# Altium schematic sheet Arriquitaun2.SchDoc
size A3
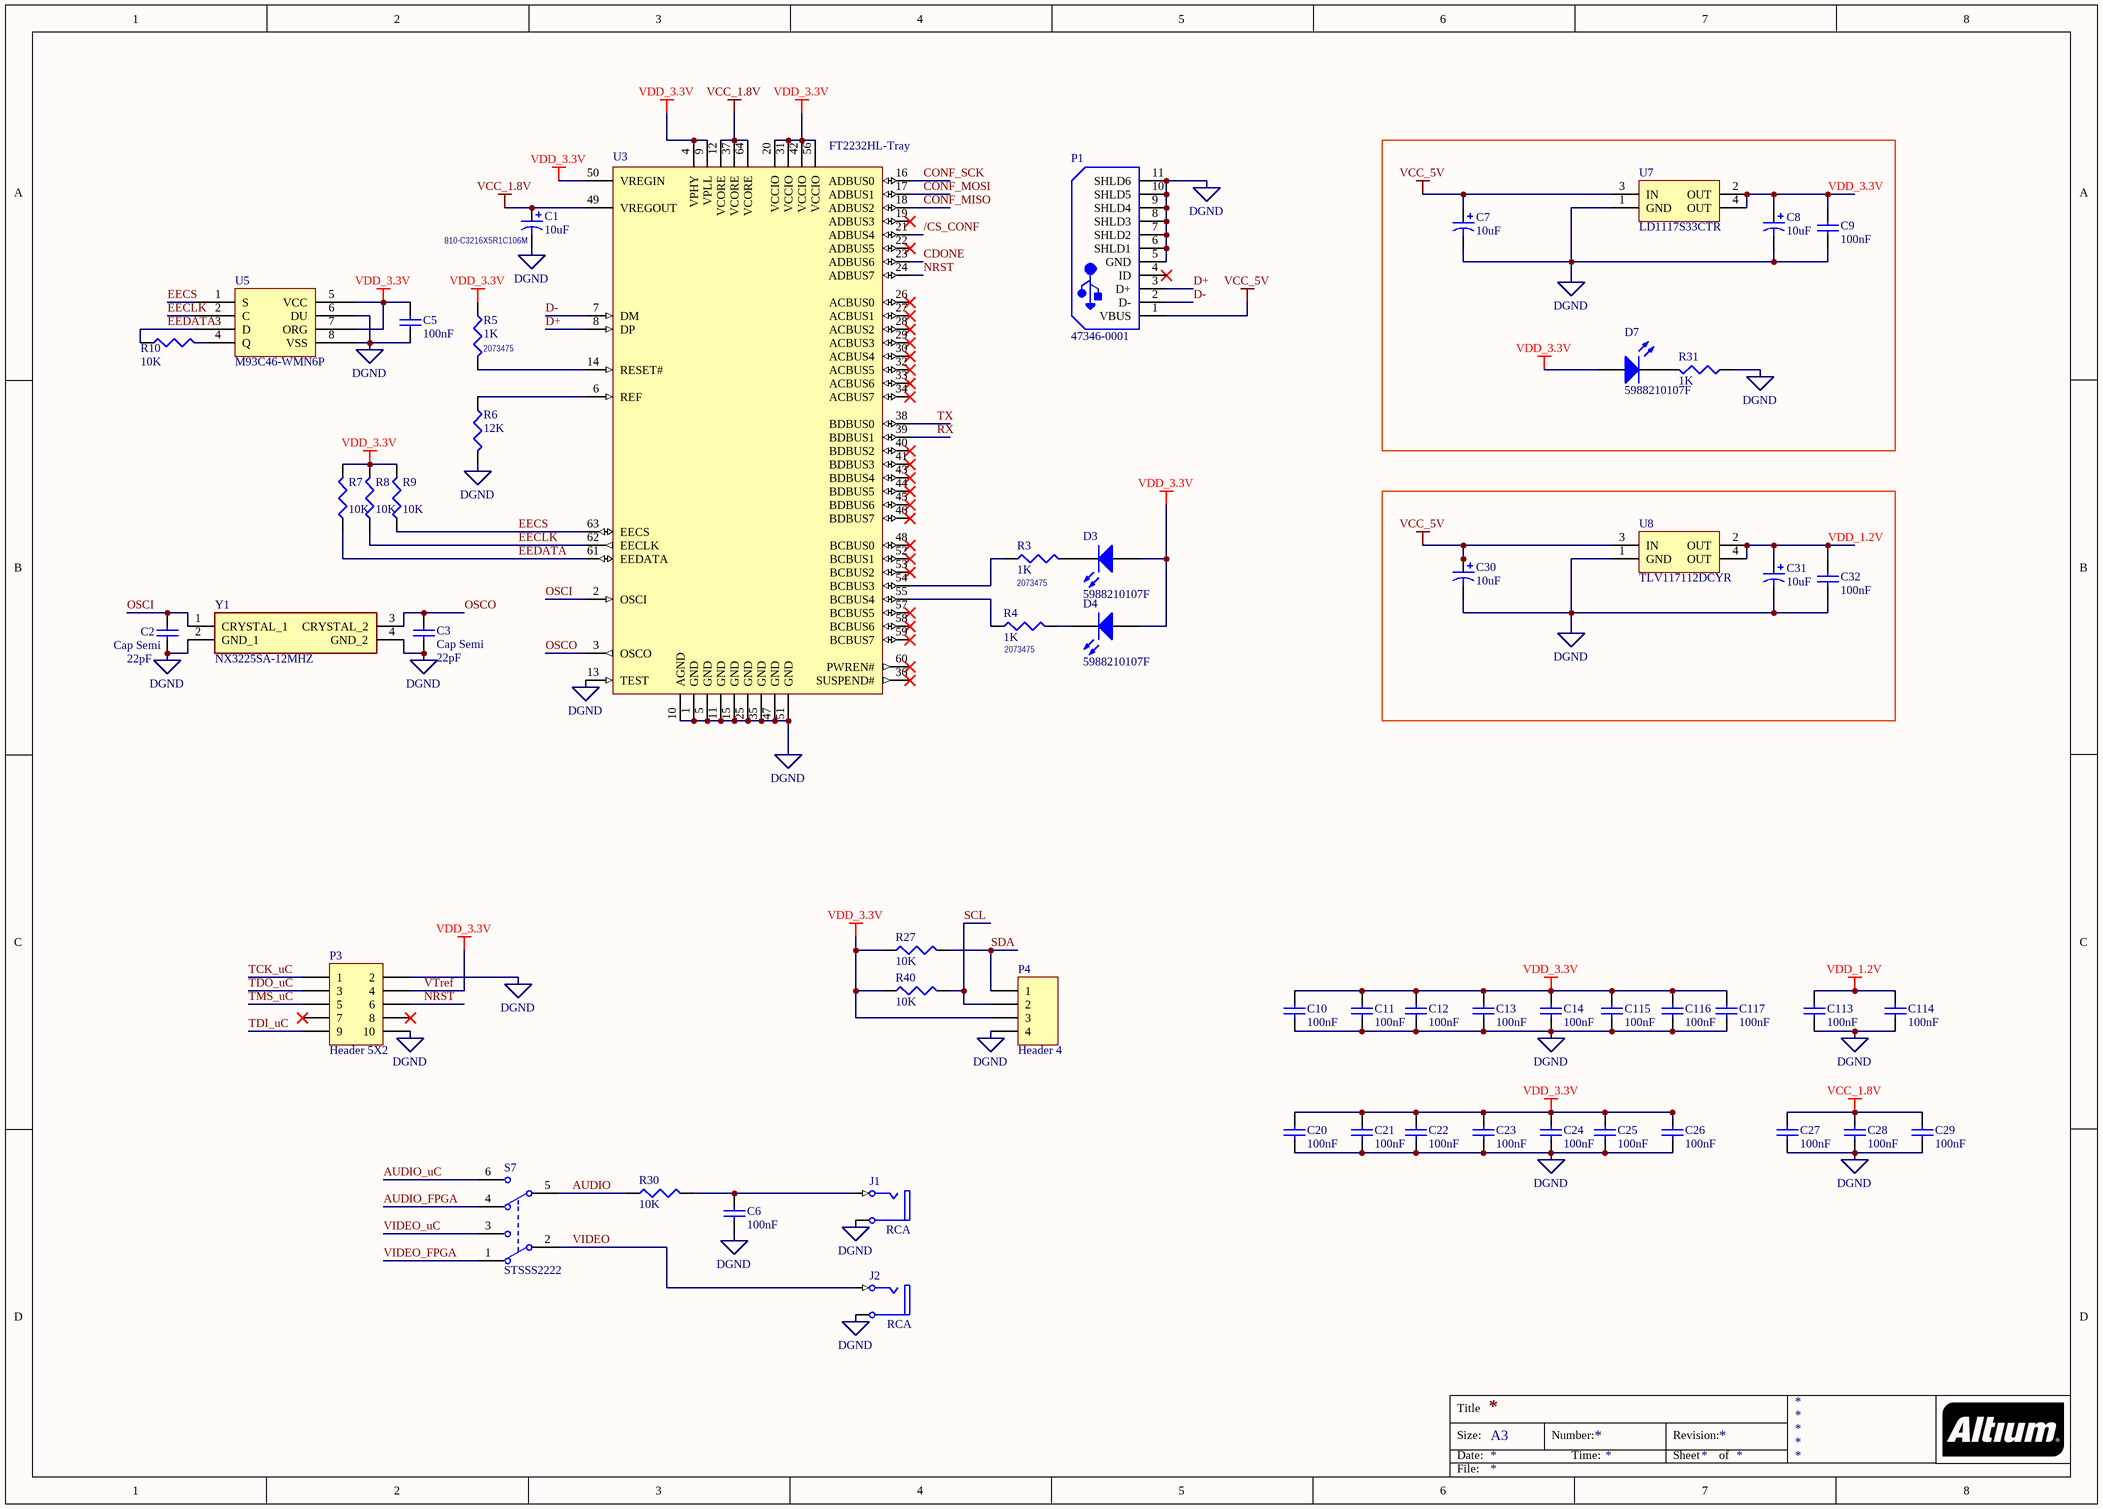
[diagram p0: Arriquitaun2.SchDoc]

## Parts
C1  value 10uF  Supplier part number 1: 810-C3216X5R1C106M  [C1206]  (hidden comment: Cap Pol1)
C2  Cap Semi  value 22pF  [C1206]
C3  Cap Semi  value 22pF  [C1206]
C5  value 100nF  [C1206]  (hidden comment: Cap Semi)
C6  value 100nF  [C1206]  (hidden comment: Cap Semi)
C7  value 10uF  [C1206]  (hidden comment: Cap Pol1)
C8  value 10uF  [C1206]  (hidden comment: Cap Pol1)
C9  value 100nF  [C1206]  (hidden comment: Cap Semi)
C10  value 100nF  [C1206]  (hidden comment: Cap Semi)
C11  value 100nF  [C1206]  (hidden comment: Cap Semi)
C12  value 100nF  [C1206]  (hidden comment: Cap Semi)
C13  value 100nF  [C1206]  (hidden comment: Cap Semi)
C14  value 100nF  [C1206]  (hidden comment: Cap Semi)
C20  value 100nF  [C1206]  (hidden comment: Cap Semi)
C21  value 100nF  [C1206]  (hidden comment: Cap Semi)
C22  value 100nF  [C1206]  (hidden comment: Cap Semi)
C23  value 100nF  [C1206]  (hidden comment: Cap Semi)
C24  value 100nF  [C1206]  (hidden comment: Cap Semi)
C25  value 100nF  [C1206]  (hidden comment: Cap Semi)
C26  value 100nF  [C1206]  (hidden comment: Cap Semi)
C27  value 100nF  [C1206]  (hidden comment: Cap Semi)
C28  value 100nF  [C1206]  (hidden comment: Cap Semi)
C29  value 100nF  [C1206]  (hidden comment: Cap Semi)
C30  value 10uF  [C1206]  (hidden comment: Cap Pol1)
C31  value 10uF  [C1206]  (hidden comment: Cap Pol1)
C32  value 100nF  [C1206]  (hidden comment: Cap Semi)
C113  value 100nF  [C1206]  (hidden comment: Cap Semi)
C114  value 100nF  [C1206]  (hidden comment: Cap Semi)
C115  value 100nF  [C1206]  (hidden comment: Cap Semi)
C116  value 100nF  [C1206]  (hidden comment: Cap Semi)
C117  value 100nF  [C1206]  (hidden comment: Cap Semi)
D3  5988210107F  [1206 - LED]
D4  5988210107F  [1206 - LED]
D7  5988210107F  [1206 - LED]
J1  RCA  [161]
J2  RCA  [161]
P1  47346-0001  [USB-MICRO-B_V]
P3  Header 5X2  [HDR2X5]
P4  Header 4  [HDR1X4]
R3  value 1K  Supplier Part Number 1: 2073475  [c1206]  (hidden comment: Res3)
R4  value 1K  Supplier Part Number 1: 2073475  [c1206]  (hidden comment: Res3)
R5  value 1K  Supplier Part Number 1: 2073475  [c1206]  (hidden comment: Res3)
R6  value 12K  [c1206]  (hidden comment: Res3)
R7  value 10K  [c1206]  (hidden comment: Res3)
R8  value 10K  [c1206]  (hidden comment: Res3)
R9  value 10K  [c1206]  (hidden comment: Res3)
R10  value 10K  [c1206]  (hidden comment: Res3)
R27  value 10K  [c1206]  (hidden comment: Res3)
R30  value 10K  [c1206]  (hidden comment: Res3)
R31  value 1K  [c1206]  (hidden comment: Res3)
R40  value 10K  [c1206]  (hidden comment: Res3)
S7  STSSS2222  [SWITCH]
U3  FT2232HL-Tray  [LQFP-64_N]
U5  M93C46-WMN6P  [SOP8_N]
U7  LD1117S33CTR  [ZZ311]
U8  TLV117112DCYR  [ZZ311]
Y1  NX3225SA-12MHZ  [NX3225SA12000MHZSTDCSR1]

## Nets
DGND: C1.2 C2.2 C3.1 C5.1 C6.1 C7.2 C8.2 C9.1 C10.1 C11.1 C12.1 C13.1 C14.1 C20.1 C21.1 C22.1 C23.1 C24.1 C25.1 C26.1 C27.1 C28.1 C29.1 C30.2 C31.2 C32.1 C113.1 C114.1 C115.1 C116.1 C117.1 J1.1A(Ground) J2.1A(Ground) P1.5(GND) P1.6(SHLD1) P1.7(SHLD2) P1.8(SHLD3) P1.9(SHLD4) P1.10(SHLD5) P1.11(SHLD6) P3.2 P3.10 P4.4 R6.2 R31.1 U3.1(GND) U3.5(GND) U3.10(AGND) U3.11(GND) U3.13(TEST) U3.15(GND) U3.25(GND) U3.35(GND) U3.47(GND) U3.51(GND) U5.6(DU) U5.8(VSS) U7.1(GND) U8.1(GND) Y1.2(GND_1) Y1.4(GND_2)
VCC_1.8V: C1.1 C27.2 C28.2 C29.2 U3.12(VCORE) U3.37(VCORE) U3.49(VREGOUT) U3.64(VCORE)
VCC_5V: C7.1 C30.1 P1.1(VBUS) U7.3(IN) U8.3(IN)
VDD_1.2V: C31.1 C32.2 C113.2 C114.2 U8.2(OUT) U8.4(OUT)
VDD_3.3V: C5.2 C8.1 C9.2 C10.2 C11.2 C12.2 C13.2 C14.2 C20.2 C21.2 C22.2 C23.2 C24.2 C25.2 C26.2 C115.2 C116.2 C117.2 D3.1(A) D4.1(A) D7.1(A) P3.4 P4.3 R5.1 R7.2 R8.2 R9.2 R27.1 R40.1 U3.4(VPHY) U3.9(VPLL) U3.20(VCCIO) U3.31(VCCIO) U3.42(VCCIO) U3.50(VREGIN) U3.56(VCCIO) U5.5(VCC) U5.7(ORG) U7.2(OUT) U7.4(OUT)  [also labelled VTref]
/CS_CONF: U3.21(ADBUS4)
AUDIO: R30.1 S7.5(COMMON2)
AUDIO_FPGA: S7.4(NC2)
AUDIO_uC: S7.6(NO2)
CDONE: U3.23(ADBUS6)
CONF_MISO: U3.18(ADBUS2)
CONF_MOSI: U3.17(ADBUS1)
CONF_SCK: U3.16(ADBUS0)
D+: P1.3(D+) U3.8(DP)
D-: P1.2(D-) U3.7(DM)
EECLK: R8.1 U3.62(EECLK) U5.2(C)
EECS: R9.1 U3.63(EECS) U5.1(S)
EEDATA: R7.1 R10.1 U3.61(EEDATA) U5.3(D)
NRST: P3.6 U3.24(ADBUS7)
OSCI: C2.1 U3.2(OSCI) Y1.1(CRYSTAL_1)
OSCO: C3.2 U3.3(OSCO) Y1.3(CRYSTAL_2)
RX: U3.39(BDBUS1)
SCL: P4.2 R40.2
SDA: P4.1 R27.2
TCK_uC: P3.1
TDI_uC: P3.9
TDO_uC: P3.3
TMS_uC: P3.5
TX: U3.38(BDBUS0)
VIDEO: J2.2B(Signal) S7.2(COMMON1)
VIDEO_FPGA: S7.1(NC1)
VIDEO_uC: S7.3(NO1)
NetC6_2: C6.2 J1.2B(Signal) R30.2
NetD3_2: D3.2(K) R3.2
NetD4_2: D4.2(K) R4.2
NetD7_2: D7.2(K) R31.2
NetR3_1: R3.1 U3.54(BCBUS3)
NetR4_1: R4.1 U3.55(BCBUS4)
NetR5_2: R5.2 U3.14(RESET#)
NetR6_1: R6.1 U3.6(REF)
NetR10_2: R10.2 U5.4(Q)

Not connected (* = marked no-connect by the designer): P1 4(ID)*; P3 7* 8*; U3 19(ADBUS3)* 22(ADBUS5)* 26(ACBUS0)* 27(ACBUS1)* 28(ACBUS2)* 29(ACBUS3)* 30(ACBUS4)* 32(ACBUS5)* 33(ACBUS6)* 34(ACBUS7)* 36(SUSPEND#)* 40(BDBUS2)* 41(BDBUS3)* 43(BDBUS4)* 44(BDBUS5)* 45(BDBUS6)* 46(BDBUS7)* 48(BCBUS0)* 52(BCBUS1)* 53(BCBUS2)* 57(BCBUS5)* 58(BCBUS6)* 59(BCBUS7)* 60(PWREN#)*

## Notes on the sheet
- Title
- Size:
- Date:
- A3
- Number:
- Time:
- Revision:
- Sheet
- of
- File:

## Library data of the parts
C1 C7 C8 C30 C31 = Cap Pol1: Polarized Capacitor (Radial); Published: 8-Jun-2000; LatestRevisionDate: 17-Jul-2002; LatestRevisionNote: Re-released for DXP Platform.; PackageReference: RB7.6-15; Publisher: Altium Limited; PackageDescription: Polarized Capacitor (Radial); 2 Leads; Supplier 1: Mouser
  C7 C8 C30 C31: Supplier part number 1: 810-C3216X5R1C106M
C2 C3 C5 C6 C9-C14 C20-C29 C32 C113-C117 = Cap Semi: Capacitor (Semiconductor SIM Model); Published: 8-Jun-2000; LatestRevisionDate: 29-May-2009; LatestRevisionNote: IPC-7351 Footprint Added.; PackageReference: C1206; Publisher: Altium Limited; PackageDescription: Chip Capacitor
  C5: Supplier 1: Mouser
  C6 C9 C32: Supplier 1: Farnell; Supplier part number 1: 1759123
  C10-C14 C20-C29 C113-C117: Supplier 1: Mouser; Supplier Part Number 1: 81-GRM31CR72D104KW3L
D3 D4 D7 = 5988210107F: LED, Rojo, Montaje Superficial, 1206 (Métrico 3216), 20 mA, 2 V, 640 nm; Published: 8-Jun-2000; LatestRevisionDate: 17-Jul-2002; LatestRevisionNote: Re-released for DXP Platform.; PackageVersion: Feb-2002; PackageReference: 3.2X1.6X1.1; Publisher: Altium Limited; PackageDescription: SM LED; 2 Flat Leads; Supplier 1: Farnell; Supplier Part Number 1: 1465997; ComponentLink1Description: Mouser; ComponentLink1URL: https://eu.mouser.com/ProductDetail/Dialight/598-8210-107F?qs=sGAEpiMZZMseGfSY3csMkcUUSK%2FIVnSgwPTZO%252Bt9HCE%3D; Supplier 2: Mouser; Supplier Part Number 2: 645-598-8210-107F
J1 J2 = RCA: RCA Phono Jack, Right Angle, Thru-Hole, Snap-In; PCB_Layout: Complies with manufacturer's recommendation.; DrillAndSlotSize: Corresponds to nominal value.; Published: 15-Jul-2004; LatestRevisionDate: 15-Jul-2004; LatestRevisionNote: Component Replaced.; DatasheetDocument: 7-Jul-2000; PackageDocument: 7-Jul-2000; PackageReference: 161; Publisher: Altium Limited; ComponentLink1Description: Manufacturer Link; ComponentLink1URL: http://www.mouser.com/kobiconn/
P1 = 47346-0001: Conectores USB MICRO USB B RECPT BTTM MOUNT ASSY; Supplier 1: Mouser; ComponentLink1Description: Mouser; ComponentLink1URL: https://eu.mouser.com/ProductDetail/Molex/47346-0001?qs=%2Fha2pyFadugJe2m2PwsxZF%2FSs5SLGnHK0WVEsekv2hnqwx5TiE8qVw%3D%3D&utm_source=octopart&utm_medium=aggregator&utm_campaign=538-47346-0001&utm_content=Molex; Supplier Part Number 1: 538-47346-0001; Supplier 2: Farnell; Supplier Part Number 2: 2119232
P3 = Header 5X2: Header, 5-Pin, Dual row; LatestRevisionDate: 17-Jul-2002; LatestRevisionNote: Re-released for DXP Platform.; Publisher: Altium Limited; Supplier 1: Farnell; Supplier Part Number 1: 1593415
P4 = Header 4: Header, 4-Pin; LatestRevisionDate: 17-Jul-2002; LatestRevisionNote: Re-released for DXP Platform.; Publisher: Altium Limited
R3-R10 R27 R30 R31 R40 = Res3: Resistor; Published: 8-Jun-2000; LatestRevisionDate: 29-May-2009; LatestRevisionNote: IPC-7351 Footprint Added.; PackageReference: J1-0603; Publisher: Altium Limited; PackageDescription: Chip Resistor
  R3-R6: Supplier 1: Farnell
  R27 R30 R40: Supplier 1: Farnell; Supplier Part Number 1: 2073356
  R31: Supplier 1: Farnell; Supplier Part Number 1: 2073475
S7 = STSSS2222: Interruptor Deslizante, DPDT, Taladro Pasante, Serie STSS2, 300 mA; Supplier 1: Farnell; Supplier Part Number 1: 1123873; Supplier 2: Newark; Supplier Part Number 2: 34M8660
U3 = FT2232HL-Tray: Dual High Speed USB To Multipurpose UART/FIFO IC, 64-pin LQFP, Tray; Manufacturer: FTDI; DatasheetVersion: ver 2.21, Jun-2012; PackageVersion: Jun-12; PackageReference: LQFP-64; PackageDescription: 64-Pin Thin Quad Flat Pack, 10 x 10 x 1.4 mm Body, 0.5 mm Pitch; PartNumber: FT2232HL-Tray; ComponentLink1Description: Manufacturer URL; ComponentLink1URL: http://www.ftdichip.com/; ComponentLink2Description: Datasheet; ComponentLink2URL: http://www.ftdichip.com/Support/Documents/DataSheets/ICs/DS_FT2232H.pdf; Supplier 1: Mouser; Supplier Part Number 1: 895-FT2232HL; Supplier 2: Digi-Key; Supplier Part Number 2: 768-1347-ND
U5 = M93C46-WMN6P: EEPROM 1 Kbit (128 x 8) 2.5V to 5.5V EEProm; Supplier 1: Mouser; Supplier Part Number 1: 511-M93C46-WMN6P; Supplier 2: Farnell; Supplier Part Number 2: 1224432; Supplier 3: Digi-Key; Supplier Part Number 3: 497-8590-5-ND
U7 = LD1117S33CTR: 800mA and 1A Low Dropout Positive Regulator 2.85V, 3.3V, 5V, and Adjustable; Published: 8-Jun-2000; LatestRevisionDate: 17-Jul-2002; LatestRevisionNote: Re-released for DXP Platform.; DatasheetVersion: Sep-1997; PackageVersion: revC; PackageReference: ZZ311; Publisher: Altium Limited; PackageDescription: SOT-223/SC-73; 4 Leads; Body 6.7 x 7.3 mm, inc. leads (LxW max); ComponentLink1Description: Manufacturer Link; ComponentLink1URL: http://www.ti.com/; ComponentLink2Description: Datasheet; ComponentLink2URL: http://www-s.ti.com/sc/ds/REG1117.pdf; Supplier 1: Mouser; Supplier Part Number 1: 595-REG1117-3.3/2K5; Supplier 2: Farnell; Supplier Part Number 2: 1467779; Supplier 3: Digi-Key; Supplier 4: Farnell; Supplier Part Number 3: 497-1241-6-ND; Supplier Part Number 4: 2253482
U8 = TLV117112DCYR: Reguladores de voltaje LDO 1A + Fixed Vltg Lo-Drpout Linear Reg; Published: 8-Jun-2000; LatestRevisionDate: 17-Jul-2002; LatestRevisionNote: Re-released for DXP Platform.; DatasheetVersion: Sep-1997; PackageVersion: revC; PackageReference: ZZ311; Publisher: Altium Limited; PackageDescription: SOT-223/SC-73; 4 Leads; Body 6.7 x 7.3 mm, inc. leads (LxW max); ComponentLink1Description: Manufacturer Link; ComponentLink1URL: http://www.ti.com/; ComponentLink2Description: Datasheet; ComponentLink2URL: http://www-s.ti.com/sc/ds/REG1117.pdf; Supplier 1: Mouser; Supplier Part Number 1: 595-TLV117112DCYR; Supplier 2: Digi-Key; Supplier Part Number 2: 296-40595-1-ND
Y1 = NX3225SA-12MHZ-STD-CSR-3: Crystal or Oscillator; Manufacturer_Name: NDK; Manufacturer_Part_Number: NX3225SA-24.000M-STD-CSR-3; Datasheet Link: https://media.digikey.com/pdf/Data%20Sheets/NDK%20PDFs/NX3225SA_STD-CSR-3.pdf; Height: 0.6mm; Mouser Part Number: 344-NX3225SA24MSTSR3; Mouser Price/Stock: https://www.mouser.com/Search/Refine.aspx?Keyword=344-NX3225SA24MSTSR3; RS Part Number: 1847826; RS Price/Stock: http://uk.rs-online.com/web/p/products/1847826; Supplier 1: Mouser; ComponentLink2Description: Mouser; ComponentLink2URL: NX3225SA-12MHZ-STD-CSR-3; Supplier Part Number 1: 344-NX3225SA12MCSR3; Supplier 2: Digi-Key; Supplier Part Number 2: 644-1179-6-ND